# Altium schematic sheet config-top.SchDoc: Config FPGA - Top
size Letter; CheckedBy: E. Chiu; CompanyName: Brinton Engineering, LLC; DrawnBy: J. Brinton; Engineer: J. Brinton; Address1: 3479 Edison Way; Address2: Menlo Park CA 94025; Address3: +1 (877) 778-8435; Address4: brintonengineering.com; Revision: 1; SheetNumber: 21; SheetTotal: 48
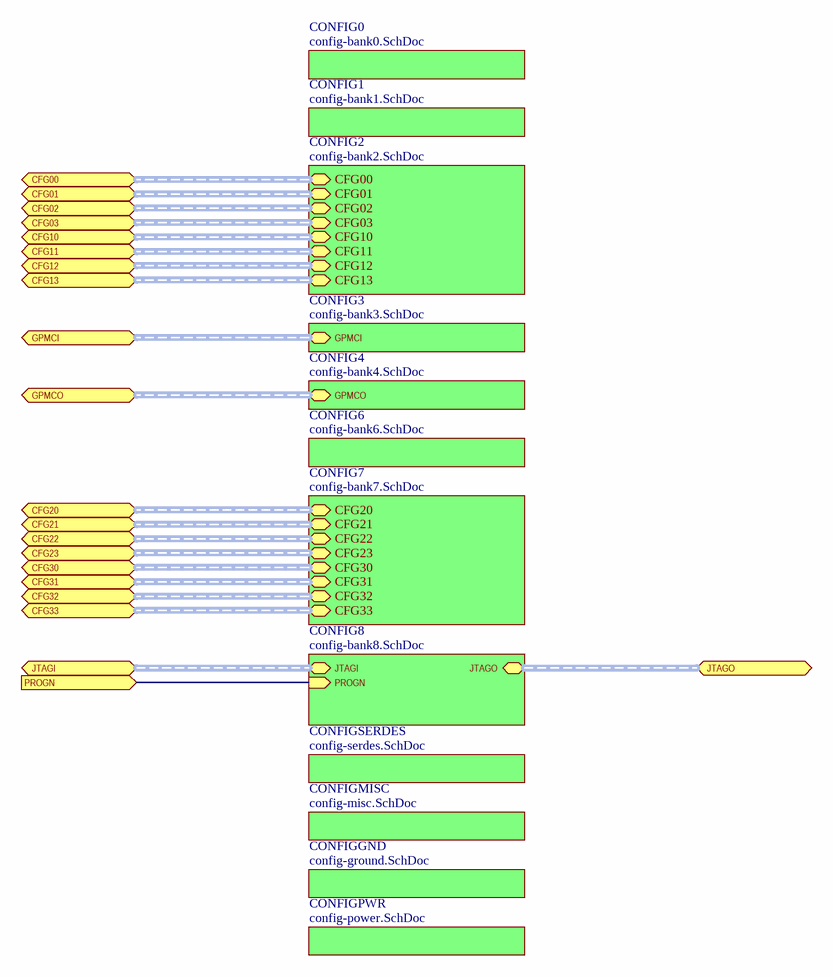
[diagram p0: config-top.SchDoc]

## Sub-sheets
CONFIG0 = config-bank0.SchDoc: no entries
CONFIG1 = config-bank1.SchDoc: no entries
CONFIG2 = config-bank2.SchDoc: CFG00 (harness CFG-1V5), CFG01 (harness CFG-1V5), CFG02 (harness CFG-1V5), CFG03 (harness CFG-1V5), CFG10 (harness CFG-1V5), CFG11 (harness CFG-1V5), CFG12 (harness CFG-1V5), CFG13 (harness CFG-1V5)
CONFIG3 = config-bank3.SchDoc: GPMCI (harness GPMC)
CONFIG4 = config-bank4.SchDoc: GPMCO (harness GPMC)
CONFIG6 = config-bank6.SchDoc: no entries
CONFIG7 = config-bank7.SchDoc: CFG20 (harness CFG-1V5), CFG21 (harness CFG-1V5), CFG22 (harness CFG-1V5), CFG23 (harness CFG-1V5), CFG30 (harness CFG-1V5), CFG31 (harness CFG-1V5), CFG32 (harness CFG-1V5), CFG33 (harness CFG-1V5)
CONFIG8 = config-bank8.SchDoc: JTAGI (harness JTAG-1V5), JTAGO (harness JTAG-1V5), PROGN (in)
CONFIGGND = config-ground.SchDoc: no entries
CONFIGMISC = config-misc.SchDoc: no entries
CONFIGPWR = config-power.SchDoc: no entries
CONFIGSERDES = config-serdes.SchDoc: no entries

## Ports
CFG00 (harness CFG-1V5), CFG01 (harness CFG-1V5), CFG02 (harness CFG-1V5), CFG03 (harness CFG-1V5), CFG10 (harness CFG-1V5), CFG11 (harness CFG-1V5), CFG12 (harness CFG-1V5), CFG13 (harness CFG-1V5), CFG20 (harness CFG-1V5), CFG21 (harness CFG-1V5), CFG22 (harness CFG-1V5), CFG23 (harness CFG-1V5), CFG30 (harness CFG-1V5), CFG31 (harness CFG-1V5), CFG32 (harness CFG-1V5), CFG33 (harness CFG-1V5), GPMCI (harness GPMC), GPMCO (harness GPMC), JTAGI (harness JTAG-1V5), JTAGO (harness JTAG-1V5), PROGN (in)

## Nets
PROGN: port PROGN, sheet CONFIG8/PROGN

## Buses and harness runs
harness port CFG00 = sheet CONFIG2/CFG00
harness port CFG01 = sheet CONFIG2/CFG01
harness port CFG02 = sheet CONFIG2/CFG02
harness port CFG03 = sheet CONFIG2/CFG03
harness port CFG10 = sheet CONFIG2/CFG10
harness port CFG11 = sheet CONFIG2/CFG11
harness port CFG12 = sheet CONFIG2/CFG12
harness port CFG13 = sheet CONFIG2/CFG13
harness port CFG20 = sheet CONFIG7/CFG20
harness port CFG21 = sheet CONFIG7/CFG21
harness port CFG22 = sheet CONFIG7/CFG22
harness port CFG23 = sheet CONFIG7/CFG23
harness port CFG30 = sheet CONFIG7/CFG30
harness port CFG31 = sheet CONFIG7/CFG31
harness port CFG32 = sheet CONFIG7/CFG32
harness port CFG33 = sheet CONFIG7/CFG33
harness port GPMCI = sheet CONFIG3/GPMCI
harness port GPMCO = sheet CONFIG4/GPMCO
harness port JTAGI = sheet CONFIG8/JTAGI
harness port JTAGO = sheet CONFIG8/JTAGO

## Notes on the sheet
- Title
- Engineer
- Revision
- Drawn By
- Checked By
- Date
- Sheet
- of